# Altium schematic sheet mboard_mem.SchDoc: =GlobalProjectName
size 209 x 297 mm; SheetNumber: Лист; SheetTotal: Листов; PageSetup: Record=PageOptions|CenterHorizontal=True|CenterVertical=True|PrintScale=1.00|XCorrection=1.00|YCorrection=1.00|PrintKind=1|BorderSize=5000000|LeftOffset=0|BottomOffset=0|Orientation=2|PaperLength=1000|PaperWidth=1000|Scale=100|PaperSource=15|PrintQuality=1200|MediaType=1|DitherType=10|PaperKind=A3|PrintScaleMode=1; Weight: -; ScaleFactor: -
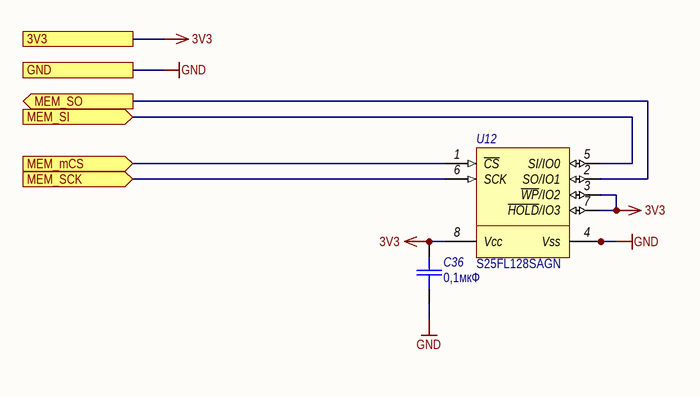
[diagram p0: mboard_mem.SchDoc]

## Parts
C36  value 0,1мкФ  [SMD_C0402]  (hidden comment: K10-79)
U12  S25FL128SAGN  [WSON-8_6x8]

## Ports
3V3, GND, MEM_mCS (in), MEM_SCK (in), MEM_SI (in), MEM_SO (out)

## Nets
3V3: C36.1 U12.3(~{WP}/IO2) U12.7(~{HOLD}/IO3) U12.8(Vcc) ; port 3V3
GND: C36.2 U12.4(Vss) U12.9(TP) ; port GND
MEM_mCS: U12.1(~{CS}) ; port MEM_mCS
MEM_SCK: U12.6(SCK) ; port MEM_SCK
MEM_SI: U12.5(SI/IO0) ; port MEM_SI
MEM_SO: U12.2(SO/IO1) ; port MEM_SO

## Notes on the sheet
- Подп. и дата
- Инв. № дубл.
- Взам. инв. №
- Инв. № подл.
- Изм.
- Лист
- № докум.
- Подп.
- Дата
- Форма 2а ГОСТ 2.104-2006
- Копировал
- Формат А4

## Library data of the parts
C36 = Capacitor: Назначение: SMD-конденсатор; Наименование: К10-79; Потребление, Вт: 0; Точность: %; Напряжение: В; Диэлектрик: *
U12 = S25FL128SAGN: Programmable NOR flash memory; Потребление, Вт: 0.1; Назначение: Programmable NOR flash memory; ComponentLink1Description: DataSheet; ComponentLink1URL: https://www.infinite-electronic.ru/datasheet/8b-S25FL256SAGBHV203.pdf; Supplier 1: Digi-Key; Supplier Part Number 1: 428-4618-ND; Наименование: S25FL128SAGN